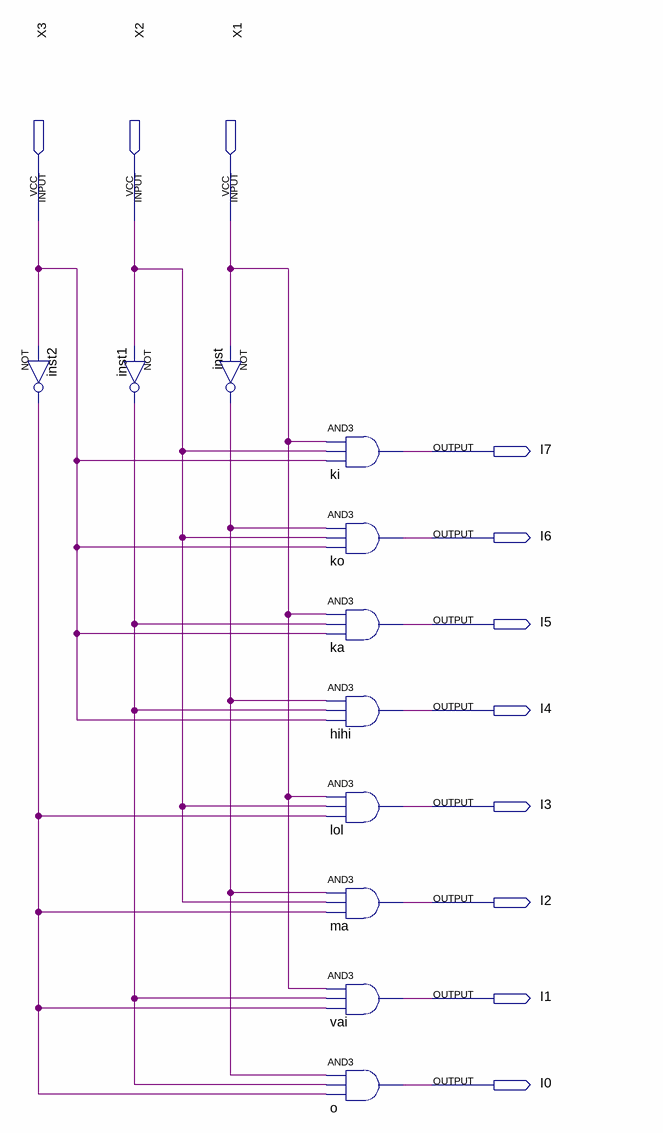
[diagram p0: schematic sheet]
// Quartus schematic block5.bdf as structural Verilog: 11 symbols, 11 pins
module block5 (
  input  X3,
  input  X2,
  input  X1,
  output I7,
  output I6,
  output I5,
  output I4,
  output I3,
  output I2,
  output I1,
  output I0
);

  wire inst1_out, inst2_out, inst_out;

  not inst2 (inst2_out, X3);
  not inst1 (inst1_out, X2);
  not inst (inst_out, X1);
  and ki (I7, X1, X2, X3);
  and ko (I6, inst_out, X2, X3);
  and ka (I5, X1, inst1_out, X3);
  and hihi (I4, inst_out, inst1_out, X3);
  and lol (I3, X1, X2, inst2_out);
  and ma (I2, inst_out, X2, inst2_out);
  and vai (I1, X1, inst1_out, inst2_out);
  and o (I0, inst_out, inst1_out, inst2_out);
endmodule
